# Altium schematic sheet VFD_CLOCK.SchDoc
size A2
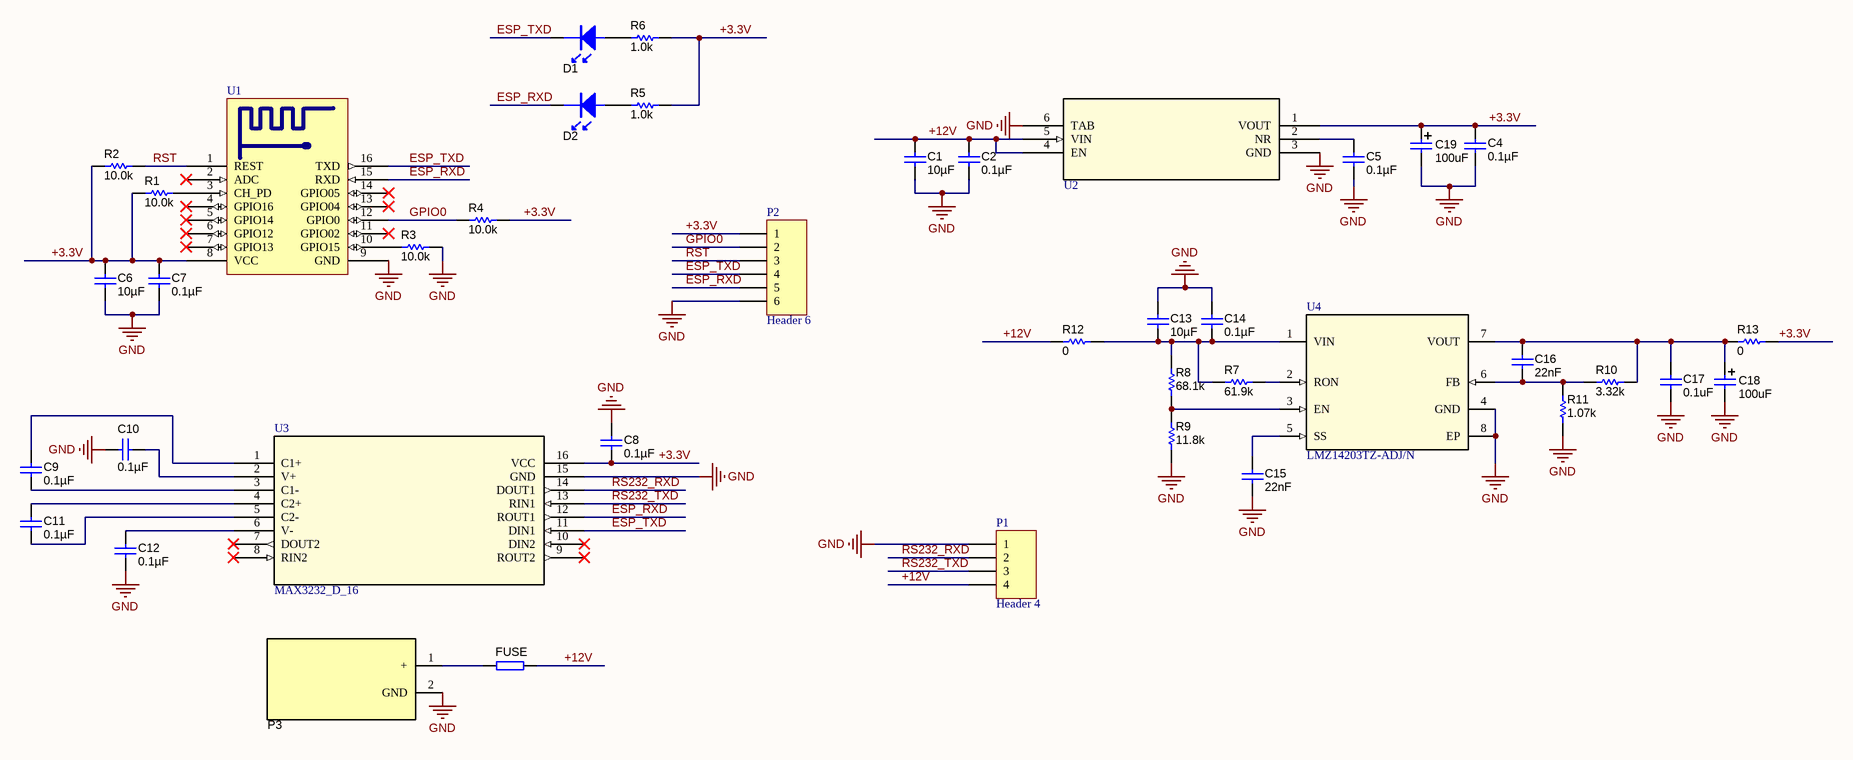
[diagram p0: VFD_CLOCK.SchDoc]

## Parts
C1  ValueDisplayed: 10µF  [0805_HV]  (hidden comment: 0805YD106KAT2A)
C2  ValueDisplayed: 0.1µF  [0805_HV]  (hidden comment: 08051C103JAT2A)
C4  ValueDisplayed: 0.1µF  [0805_HV]  (hidden comment: 08051C103JAT2A)
C5  ValueDisplayed: 0.1µF  [0805_HV]  (hidden comment: 08051C103JAT2A)
C6  ValueDisplayed: 10µF  [0805_HV]  (hidden comment: 0805YD106KAT2A)
C7  ValueDisplayed: 0.1µF  [0805_HV]  (hidden comment: 08051C103JAT2A)
C8  ValueDisplayed: 0.1µF  [0805_HV]  (hidden comment: 08051C103JAT2A)
C9  ValueDisplayed: 0.1µF  [0805_HV]  (hidden comment: 08051C103JAT2A)
C10  ValueDisplayed: 0.1µF  [0805_HV]  (hidden comment: 08051C103JAT2A)
C11  ValueDisplayed: 0.1µF  [0805_HV]  (hidden comment: 08051C103JAT2A)
C12  ValueDisplayed: 0.1µF  [0805_HV]  (hidden comment: 08051C103JAT2A)
C13  ValueDisplayed: 10µF  [0805_HV]  (hidden comment: 0805YD106KAT2A)
C14  ValueDisplayed: 0.1µF  [0805_HV]  (hidden comment: 08051C103JAT2A)
C15  ValueDisplayed: 22nF  [0805_HV]  (hidden comment: 08051C103JAT2A)
C16  ValueDisplayed: 22nF  [0805_HV]  (hidden comment: 08051C103JAT2A)
C17  ValueDisplayed: 0.1uF  [0805_HV]  (hidden comment: 08051C103JAT2A)
C18  100uF  [CAP]
C19  100uF  [CAP]
D1  RED  [LED0805]  (value not drawn)
D2  RED  [LED0805]  (value not drawn)
FUSE  (no value)  [1206]
P1  Header 4  [HDR1X4]
P2  Header 6  [HDR1X6]
P3  Used in BOM report  [PWR5.5]  (value not drawn)
R1  ValueDisplayed: 10.0k  [0805_HV]  (hidden comment: CRCW080510K0FKEA)
R2  ValueDisplayed: 10.0k  [0805_HV]  (hidden comment: CRCW080510K0FKEA)
R3  ValueDisplayed: 10.0k  [0805_HV]  (hidden comment: CRCW080510K0FKEA)
R4  ValueDisplayed: 10.0k  [0805_HV]  (hidden comment: CRCW080510K0FKEA)
R5  ValueDisplayed: 1.0k  [0805_HV]  (hidden comment: CRCW080510K0FKEA)
R6  ValueDisplayed: 1.0k  [0805_HV]  (hidden comment: CRCW080510K0FKEA)
R7  ValueDisplayed: 61.9k  [0805_HV]  (hidden comment: CRCW080510K0FKEA)
R8  ValueDisplayed: 68.1k  [0805_HV]  (hidden comment: CRCW080510K0FKEA)
R9  ValueDisplayed: 11.8k  [0805_HV]  (hidden comment: CRCW080510K0FKEA)
R10  ValueDisplayed: 3.32k  [0805_HV]  (hidden comment: CRCW080510K0FKEA)
R11  ValueDisplayed: 1.07k  [0805_HV]  (hidden comment: CRCW080510K0FKEA)
R12  ValueDisplayed: 0  [0805_HV]  (hidden comment: CRCW080510K0FKEA)
R13  ValueDisplayed: 0  [0805_HV]  (hidden comment: CRCW080510K0FKEA)
U1  ESP-12  [ESP_12]  (value not drawn)
U2  REG104-33  [TO-263]  (value not drawn)
U3  MAX3232_D_16  [D16]
U4  LMZ14203TZ-ADJ/N  [NDW0007A]

## Nets
GND: C1.2 C2.2 C4.2 C5.2 C6.2 C7.2 C8.2 C10.2 C12.2 C13.1 C14.1 C15.1 C17.1 C18.2 C19.2 P1.1 P2.6 P3.2(GND) R3.1 R9.2 R11.2 U1.9(GND) U2.3(GND) U2.6(TAB) U3.15(GND) U4.4(GND) U4.8(EP)
+3.3V: C4.1 C6.1 C7.1 C8.1 C19.1 P2.1 R1.2 R2.2 R4.1 R5.1 R6.1 R13.2 U1.8(VCC) U2.1(VOUT) U3.16(VCC)
+12V: C1.1 C2.1 FUSE.2 P1.4 R12.1 U2.4(EN) U2.5(VIN)
ESP_RXD: D2.2 P2.5 U1.15(RXD) U3.12(ROUT1)
ESP_TXD: D1.2 P2.4 U1.16(TXD) U3.11(DIN1)
GPIO0: P2.2 R4.2 U1.12(GPIO0)
RS232_RXD: P1.2 U3.14(DOUT1)
RS232_TXD: P1.3 U3.13(RIN1)
RST: P2.3 R2.1 U1.1(REST)
NetC5_1: C5.1 U2.2(NR)
NetC9_1: C9.1 U3.3(C1-)
NetC9_2: C9.2 U3.1(C1+)
NetC10_1: C10.1 U3.2(V+)
NetC11_1: C11.1 U3.5(C2-)
NetC11_2: C11.2 U3.4(C2+)
NetC12_1: C12.1 U3.6(V-)
NetC13_2: C13.2 C14.2 R7.2 R8.1 R12.2 U4.1(VIN)
NetC15_2: C15.2 U4.5(SS)
NetC16_1: C16.1 R10.1 R11.1 U4.6(FB)
NetC16_2: C16.2 C17.2 C18.1 R10.2 R13.1 U4.7(VOUT)
NetD1_1: D1.1 R6.2
NetD2_1: D2.1 R5.2
NetFUSE_1: FUSE.1 P3.1(+)
NetR1_1: R1.1 U1.3(CH_PD)
NetR3_2: R3.2 U1.10(GPIO15)
NetR7_1: R7.1 U4.2(RON)
NetR8_2: R8.2 R9.1 U4.3(EN)

Not connected (* = marked no-connect by the designer): U1 2(ADC)* 4(GPIO16)* 5(GPIO14)* 6(GPIO12)* 7(GPIO13)* 11(GPIO02)* 13(GPIO04)* 14(GPIO05)*; U3 7(DOUT2)* 8(RIN2)* 9(ROUT2)* 10(DIN2)*

## Library data of the parts
C1 C6 C13 = 0805YD106KAT2A: CAP, CERM, 10 µF, 16 V, +/- 10%, X5R, 0805; Manufacturer: AVX; Polarized: N; CompType: Capacitor; Value: 10uF; U/M: EA; Cap_F: 0.00001; Tolerance_%: 10; Value1: Unknown; VDC_V: 16; Value2: 16V; TaMin_C: -55; TaMax_C: 85; Cap_Case: 0805; SizeArea_mm2: 2.5; SizeAreaWB_mm2: 6.75; SizeX_mm: 2; SizeY_mm: 1.25; SizeZ_mm: 1.45; AEC Category: Q200; SymbolVersion: 2008-07-09; PartNumber: 0805YD106KAT2A; PackageReference: 0805; RoHS: Y; MountType: SMT; Technology: Ceramic; TempCo: X5R; Published: 2008-06-19; Publisher: Texas Instruments; LatestRevisionDate: 2016-08-09; ComponentLink1Description: Datasheet link; ComponentLink1URL: http://datasheets.avx.com/cx5r.pdf; Supplier 1: Digi-Key; Supplier Part Number 1: 478-5165-1-ND; Supplier 2: Mouser; Supplier Part Number 2: 581-0805YD106K; Supplier 3: Farnell; Supplier Part Number 3: 2281019; AEC Qualified: N; AEC Grade: N/A
C2 C4 C5 C7-C12 C14-C17 = 08051C103JAT2A: CAP, CERM, 0.01 µF, 100 V, +/- 5%, X7R, 0805; Manufacturer: AVX; Polarized: N; CompType: Capacitor; Value: 0.01uF; U/M: EA; Cap_F: 0.00000001; Tolerance_%: 5; ESR_ohm: 0.078; Value1: 0.078 ohm; VDC_V: 100; Value2: 100V; TaMin_C: -55; TaMax_C: 125; Cap_Case: 0805; SizeArea_mm2: 2.5; SizeAreaWB_mm2: 6.75; SizeX_mm: 2; SizeY_mm: 1.25; SizeZ_mm: 1.45; AEC Category: Q200; SymbolVersion: 2008-07-09; PartNumber: 08051C103JAT2A; PackageReference: 0805; RoHS: Y; MountType: SMT; Technology: Ceramic; TempCo: X7R; Published: 2008-06-19; Publisher: Texas Instruments; LatestRevisionDate: 2016-08-09; ComponentLink1Description: Datasheet link; ComponentLink1URL: http://datasheets.avx.com/X7RDielectric.pdf; Supplier 1: Digi-Key; Supplier Part Number 1: 478-3745-1-ND; Supplier 2: Mouser; Supplier Part Number 2: 581-08051C103J; Supplier 3: Farnell; Supplier Part Number 3: 1396066; AEC Qualified: N; AEC Grade: N/A
C18 C19 = Cap_100uF: Manufacturer: Used in BOM report; CompType: Used in some BOM reports.  Useful for finding later.; MountType: SMT, TH, or N/A; RoHS: Used in BOM report.  Use Y or N.; PartNumber: Used in BOM report; PackageReference: eg:  0603, used in PnP report; ComponentLink1Description: Datasheet Link; Alternate PartNumber: -; Alternate Manufacturer: -
D1 D2 = LED: LED·¢¹â¹Ü
FUSE = R: µç×è
P1 = Header 4: Header, 4-Pin; LatestRevisionDate: 17-Jul-2002; LatestRevisionNote: Re-released for DXP Platform.; Publisher: Altium Limited
P2 = Header 6: Header, 6-Pin; LatestRevisionDate: 17-Jul-2002; LatestRevisionNote: Re-released for DXP Platform.; Publisher: Altium Limited
P3 = PWR5.5: CompType: Used in some BOM reports.  Useful for finding later.; Manufacturer: Used in BOM report; MountType: SMT, TH, or N/A; RoHS: Used in BOM report.  Use Y or N.; PartNumber: Used in BOM report; PackageReference: eg:  0603, used in PnP report; ComponentLink1Description: Datasheet Link; Alternate PartNumber: -; Alternate Manufacturer: -
R1-R13 = CRCW080510K0FKEA: RES, 10.0 k, 1%, 0.125 W, 0805; Manufacturer: Vishay-Dale; CompType: Resistor; Value: 10.0k; Res_ohm: 10000; Value_Code: 10k0; Tolerance_%: 1; Power_W: 0.125; Value2: 0.125W; VDC_V: 150; TempCo: 100 ppm/C; SizeArea_mm2: 2.5; SizeX_mm: 2; SizeY_mm: 1.25; SizeZ_mm: 1.45; EIA_Code: E96; U/M: EA; AEC Category: Q200; SymbolVersion: 2009-05-29; PartNumber: CRCW080510K0FKEA; PackageReference: 0805; RoHS: Y; Value1: 1%; MountType: SMT; Technology: Thick Film; Published: 2008-06-26; Publisher: Texas Instruments; LatestRevisionDate: 2016-08-02; ComponentLink1Description: Datasheet link; ComponentLink1URL: http://www.vishay.com/docs/20035/dcrcwe3.pdf; Supplier 1: Digi-Key; Supplier Part Number 1: 541-10.0KCCT-ND; Supplier 2: Mouser; Supplier Part Number 2: 71-CRCW0805-10K-E3; Supplier 3: Farnell; Supplier Part Number 3: 1469856; AEC Qualified: ?
U2 = REG104-33: Imported; Manufacturer_Part_Number: lp38502ts-adjnopb; Vendor: National; Value: Value; Type: Type; RefDes: RefDes
U3 = MAX3232_D_16: Imported; Manufacturer: Texas Instruments; INDUSTRY_STD_PKG_TYPE: SOIC; FAMILY_NAME: RS-232; PIN_COUNT: 16; PACKAGE_DESIGNATOR: D; Datasheet_URL: http://www.ti.com/lit/gpn/MAX3232; GENERIC_PART_NUMBER: MAX3232; Vendor: Texas Instruments; Manufacturer_Part_Number: max3232_d_16; Value: Value; Type: Type; RefDes: RefDes
U4 = LMZ14203TZ-ADJ/N: Imported; Manufacturer: Texas Instruments; PartNumber: LMZ14203TZ-ADJ/NOPB; RefDes: RefDes; TYPE: TYPE; Value: Value